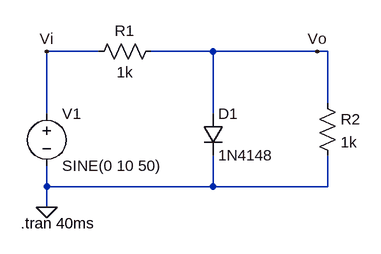
[diagram p0: schematic Diode_Simulation_3.3.asc]
Diode_Simulation_3.3.asc, the LTspice schematic file:
Version 4.1
SHEET 1 880 680
WIRE 176 64 96 64
WIRE 352 64 256 64
WIRE 512 64 352 64
WIRE 528 64 512 64
WIRE 528 144 528 64
WIRE 96 160 96 64
WIRE 352 160 352 64
WIRE 96 272 96 240
WIRE 352 272 352 224
WIRE 352 272 96 272
WIRE 528 272 528 224
WIRE 528 272 352 272
WIRE 96 304 96 272
FLAG 96 304 0
FLAG 96 64 Vi
FLAG 512 64 Vo
SYMBOL res 272 48 R90
WINDOW 0 0 56 VBottom 2
WINDOW 3 32 56 VTop 2
SYMATTR InstName R1
SYMATTR Value 1k
SYMBOL diode 336 160 R0
SYMATTR InstName D1
SYMATTR Value 1N4148
SYMBOL res 512 128 R0
SYMATTR InstName R2
SYMATTR Value 1k
SYMBOL voltage 96 144 R0
SYMATTR InstName V1
SYMATTR Value SINE(0 10 50)
TEXT 56 328 Left 2 !.tran 40ms

The netlist it stands for:
* Diode_Simulation_3.3.asc
R1 Vo Vi 1k
D1 Vo 0 1N4148
R2 Vo 0 1k
V1 Vi 0 SINE(0 10 50)
.model D D
.lib standard.dio
.tran 40ms
.backanno
.end